# Altium schematic sheet output.SchDoc
size A; SheetNumber: 3; SheetTotal: 3
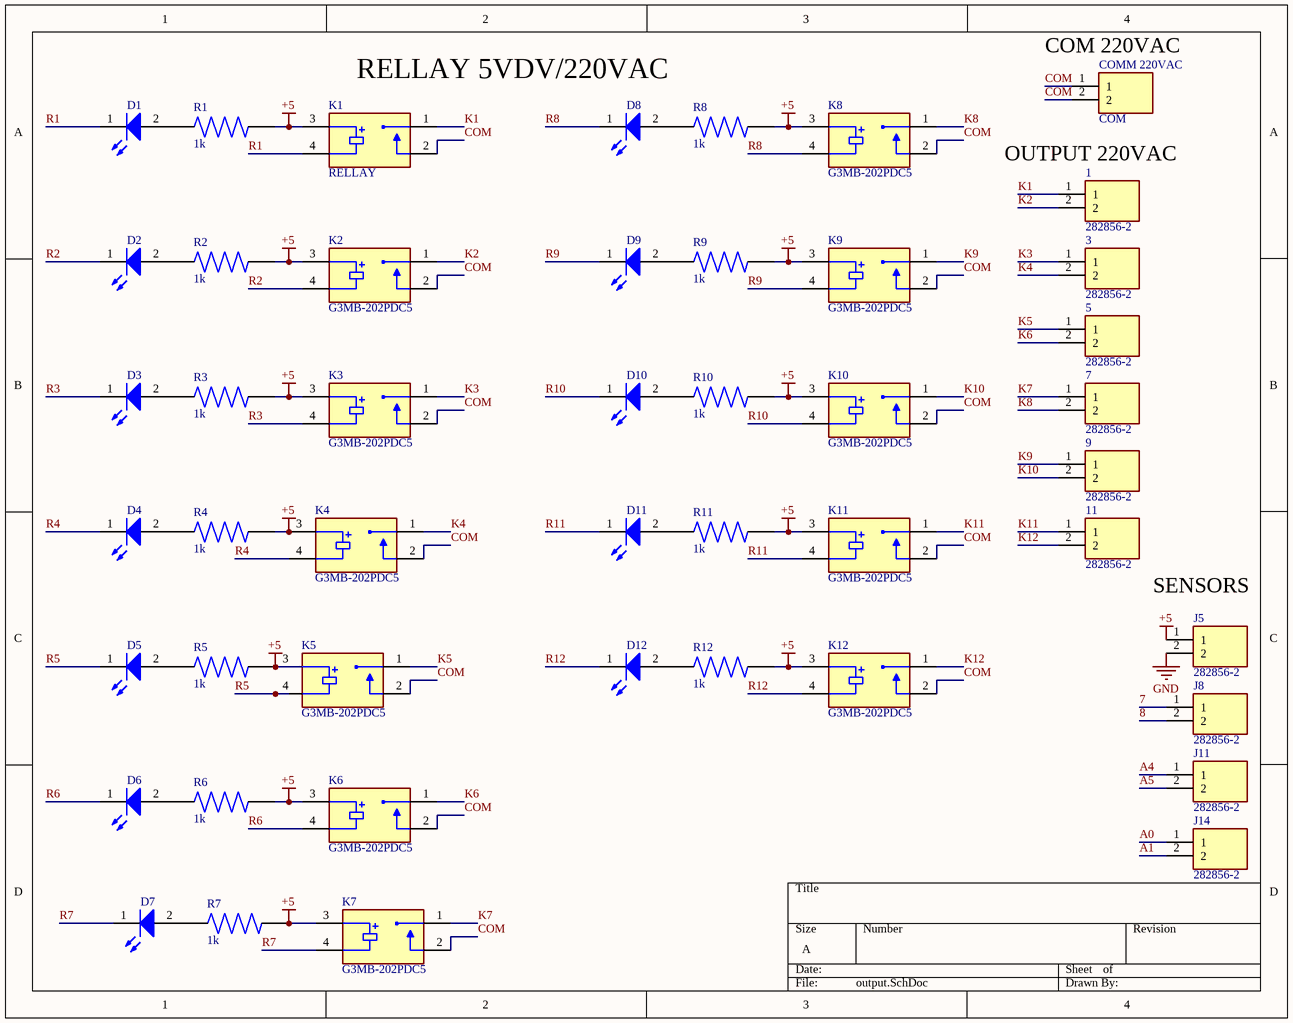
[diagram p0: output.SchDoc]

## Parts
1  282856-2  [TE_282856-2]
3  282856-2  [TE_282856-2]
5  282856-2  [TE_282856-2]
7  282856-2  [TE_282856-2]
9  282856-2  [TE_282856-2]
11  282856-2  [TE_282856-2]
COMM_220VAC  COM  [TE_282856-2]
D1  Infrared, 1.4V, 140°  [WL-SICW_0805_L2W1.3H0.8]  (value not drawn)
D2  Infrared, 1.4V, 140°  [WL-SICW_0805_L2W1.3H0.8]  (value not drawn)
D3  Infrared, 1.4V, 140°  [WL-SICW_0805_L2W1.3H0.8]  (value not drawn)
D4  Infrared, 1.4V, 140°  [WL-SICW_0805_L2W1.3H0.8]  (value not drawn)
D5  Infrared, 1.4V, 140°  [WL-SICW_0805_L2W1.3H0.8]  (value not drawn)
D6  Infrared, 1.4V, 140°  [WL-SICW_0805_L2W1.3H0.8]  (value not drawn)
D7  Infrared, 1.4V, 140°  [WL-SICW_0805_L2W1.3H0.8]  (value not drawn)
D8  Infrared, 1.4V, 140°  [WL-SICW_0805_L2W1.3H0.8]  (value not drawn)
D9  Infrared, 1.4V, 140°  [WL-SICW_0805_L2W1.3H0.8]  (value not drawn)
D10  Infrared, 1.4V, 140°  [WL-SICW_0805_L2W1.3H0.8]  (value not drawn)
D11  Infrared, 1.4V, 140°  [WL-SICW_0805_L2W1.3H0.8]  (value not drawn)
D12  Infrared, 1.4V, 140°  [WL-SICW_0805_L2W1.3H0.8]  (value not drawn)
J5  282856-2  [TE_282856-2]
J8  282856-2  [TE_282856-2]
J11  282856-2  [TE_282856-2]
J14  282856-2  [TE_282856-2]
K1  RELLAY  [RELAY_G3MB-202PDC5]
K2  G3MB-202PDC5  [RELAY_G3MB-202PDC5]
K3  G3MB-202PDC5  [RELAY_G3MB-202PDC5]
K4  G3MB-202PDC5  [RELAY_G3MB-202PDC5]
K5  G3MB-202PDC5  [RELAY_G3MB-202PDC5]
K6  G3MB-202PDC5  [RELAY_G3MB-202PDC5]
K7  G3MB-202PDC5  [RELAY_G3MB-202PDC5]
K8  G3MB-202PDC5  [RELAY_G3MB-202PDC5]
K9  G3MB-202PDC5  [RELAY_G3MB-202PDC5]
K10  G3MB-202PDC5  [RELAY_G3MB-202PDC5]
K11  G3MB-202PDC5  [RELAY_G3MB-202PDC5]
K12  G3MB-202PDC5  [RELAY_G3MB-202PDC5]
R1  1k  [RESC3216X70N]
R2  1k  [RESC3216X70N]
R3  1k  [RESC3216X70N]
R4  1k  [RESC3216X70N]
R5  1k  [RESC3216X70N]
R6  1k  [RESC3216X70N]
R7  1k  [RESC3216X70N]
R8  1k  [RESC3216X70N]
R9  1k  [RESC3216X70N]
R10  1k  [RESC3216X70N]
R11  1k  [RESC3216X70N]
R12  1k  [RESC3216X70N]

## Nets
+5: J5.1 K1.3 K2.3 K3.3 K4.3 K5.3 K6.3 K7.3 K8.3 K9.3 K10.3 K11.3 K12.3 R1.2 R2.2 R3.2 R4.2 R5.2 R6.2 R7.2 R8.2 R9.2 R10.2 R11.2 R12.2
GND: J5.2
7: J8.1
8: J8.2
A0: J14.1
A1: J14.2
A4: J11.1
A5: J11.2
COM: COMM_220VAC.1 COMM_220VAC.2 K1.2 K2.2 K3.2 K4.2 K5.2 K6.2 K7.2 K8.2 K9.2 K10.2 K11.2 K12.2
K1: 1.1 K1.1
K2: 1.2 K2.1
K3: 3.1 K3.1
K4: 3.2 K4.1
K5: 5.1 K5.1
K6: 5.2 K6.1
K7: 7.1 K7.1
K8: 7.2 K8.1
K9: 9.1 K9.1
K10: 9.2 K10.1
K11: 11.1 K11.1
K12: 11.2 K12.1
R1: D1.1(K) K1.4
R2: D2.1(K) K2.4
R3: D3.1(K) K3.4
R4: D4.1(K) K4.4
R5: D5.1(K) K5.4
R6: D6.1(K) K6.4
R7: D7.1(K) K7.4
R8: D8.1(K) K8.4
R9: D9.1(K) K9.4
R10: D10.1(K) K10.4
R11: D11.1(K) K11.4
R12: D12.1(K) K12.4
NetD1_2: D1.2(A) R1.1
NetD2_2: D2.2(A) R2.1
NetD3_2: D3.2(A) R3.1
NetD4_2: D4.2(A) R4.1
NetD5_2: D5.2(A) R5.1
NetD6_2: D6.2(A) R6.1
NetD7_2: D7.2(A) R7.1
NetD8_2: D8.2(A) R8.1
NetD9_2: D9.2(A) R9.1
NetD10_2: D10.2(A) R10.1
NetD11_2: D11.2(A) R11.1
NetD12_2: D12.2(A) R12.1

## Notes on the sheet
- RELLAY 5VDV/220VAC
- (near COMM_220VAC) COM 220VAC
- OUTPUT 220VAC
- (near J5) SENSORS

## Library data of the parts
1 3 5 7 9 11 COMM_220VAC J5 J8 J11 J14 = 282856-2: TERMI-BLOK PCB MOUNT 2P; MF: TE Connectivity; Purchase-URL: https://pricing.snapeda.com/search/part/282856-2/?ref=eda; Package: None; MP: 282856-2; EU_RoHS_Compliance: Compliant with Exemptions; Price: None; Availability: In Stock; Value: *; Check_prices: https://www.snapeda.com/parts/282856-2/TE+Connectivity+AMP+Connectors/view-part/?ref=eda; SnapEDA_Link: https://www.snapeda.com/parts/282856-2/TE+Connectivity+AMP+Connectors/view-part/?ref=snap
D1-D12 = 15408085BA400: WL-SICW SMT Chip LED Infrared Waterclear, size 0805, Infrared, 1.4V, 140°; Manufacturer: Wurth Elektronik; Case/Size Code: 0805; Centroid Wavelength: 845nm; Chip Technology: AlGaAs; Forward Voltage Max: 2V; Peak Wavelength: 850nm; Radiant Intensity: 1.5mW/sr; Radiant Intensity Min: 0.6mW/sr; name: by Ammar Haggag; Manufacturer Part Number: 15408085BA400; Category: Infrared LEDs; Match Code: WL-SICW; ComponentLink1Description: Website Link; ComponentLink1URL: https://www.we-online.com/redexpert/article/15408085BA400?ad; ComponentLink2Description: Datasheet Link; ComponentLink2URL: https://www.we-online.com/redexpert/spec/15408085BA400?ad; Mount: Surface Mount; Operating Temperature Max: 85°C; Operating Temperature Min: -40°C; Packaging: Tape and Reel; Length: 2mm; Width: 1.3mm; Height: 0.8mm; Emitting Color: Infrared; Forward Voltage: 1.4V; Viewing Angle: 140°
K1-K12 = G3MB-202PDC5: Solid State SPST-NO (1 Form A) 4-SIP; MF: Omron Automation; SnapEDA_Link: https://www.snapeda.com/parts/G3MB-202P%20DC5/Omron+Automation+and+Safety/view-part/?ref=snap; Value: *; MP: G3MB-202P DC5; Availability: Not in stock; Check_prices: https://www.snapeda.com/parts/G3MB-202P%20DC5/Omron+Automation+and+Safety/view-part/?ref=eda; Package: None; Price: None
R1-R12 = FCR1206J10R: Res 1206 10 Ohm 5% 1/8W Â±500ppm/Â°C Molded SMD SMD T/R; Resistance: 10; Power_Rating: .125 W; MF: TE Connectivity; name: by Ammar Haggag; DigiKey-Purchase-URL: https://snapeda.com/shop?store=DigiKey&id=988597; Package: 1206; EU_RoHS_Compliance: Compliant with Exemptions; Tolerance: 5%; Value: *; MP: FCR1206J10R; Price: None; SnapEDA_Link: https://www.snapeda.com/parts/FCR1206J10R/TE%20Connectivity%20Passive%20Product/view-part/988597/?ref=snap; Mouser-Purchase-URL: https://snapeda.com/shop?store=Mouser&id=988597; Availability: Warning